# Altium schematic sheet monitoring-sources-with-mbed-hw.SchDoc
size A4; DrawnBy: Rogério J. Marcondeli / Samuel C. Z. Fraga
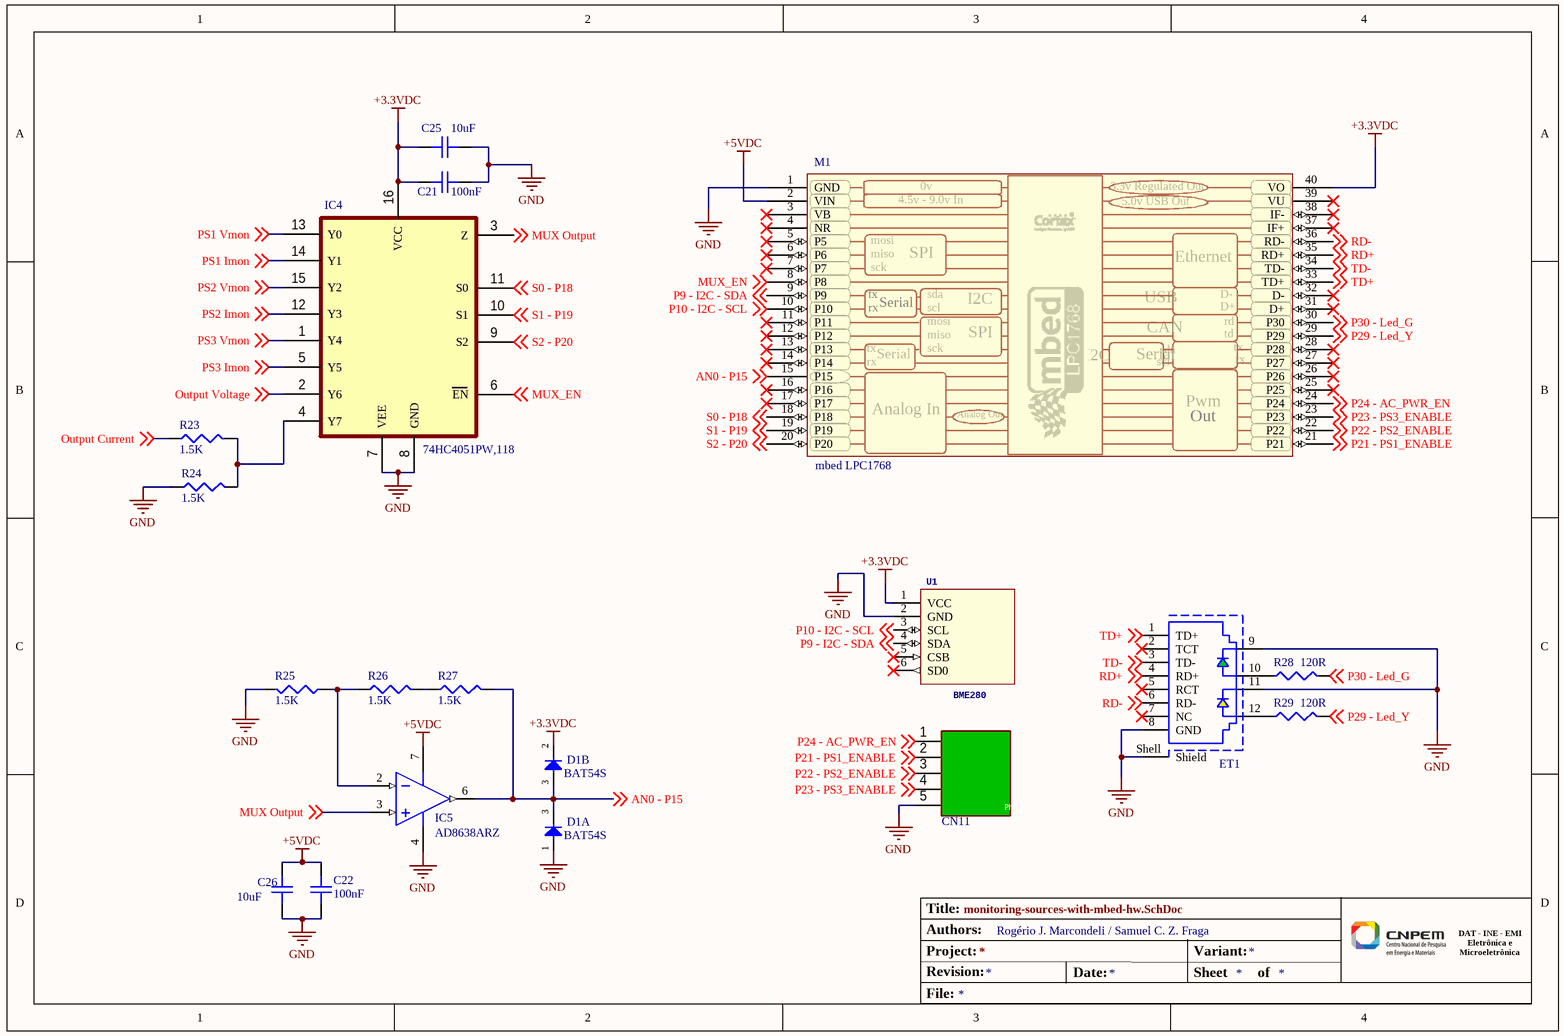
[diagram p0: monitoring-sources-with-mbed-hw.SchDoc]

## Parts
C21  100nF  [C0805]
C22  100nF  [C0805]
C25  10uF  [C0805]
C26  10uF  [C0805]
CN11  1879311  [Conector Phoenix 5 vias 1879311]  (value not drawn)
D1  BAT54S  [SOT23-3]  (parts A,B of 2)
ET1  7499010121A  [7499010121A]  (value not drawn)
IC4  8-channel analog multiplexer, TSSOP-16  [TSSOP-16]  (value not drawn)
IC5  AD8638ARZ  [SOIC-N-8]
M1  mbed LPC1768  [DIP40-LPC1768]
R23  1.5K  [R0603]
R24  1.5K  [R0603]
R25  1.5K  [R0603]
R26  1.5K  [R0603]
R27  1.5K  [R0603]
R28  120R  [R0805]
R29  120R  [R0805]
U1  BME280  [BME280]

## Nets
+3.3VDC: C21.2 C25.1 D1.2(C) IC4.16(VCC) M1.40(VO) U1.1(VCC)
+5VDC: C22.2 C26.1 IC5.7(V+) M1.2(VIN)
GND: C21.1 C22.1 C25.2 C26.2 CN11.5 D1.1(A) ET1.8(GND) ET1.9(KG) ET1.11(KY) ET1.Shell(Shield) IC4.7(VEE) IC4.8(GND) IC5.4(V-) M1.1(GND) R24.1 R25.2 U1.2(GND)
AN0 - P15: D1.3(COMAC) IC5.6(Output) M1.15(P15) R27.2 ; off-sheet AN0 - P15
MUX Output: IC4.3(Z) IC5.3(+In) ; off-sheet MUX Output
MUX_EN: IC4.6(EN) M1.8(P8) ; off-sheet MUX_EN
Output Current: R23.1 ; off-sheet Output Current
Output Voltage: IC4.2(Y6) ; off-sheet Output Voltage
P9 - I2C - SDA: M1.9(P9) U1.4(SDA) ; off-sheet P9 - I2C - SDA
P10 - I2C - SCL: M1.10(P10) U1.3(SCL) ; off-sheet P10 - I2C - SCL
P21 - PS1_ENABLE: CN11.2 M1.21(P21) ; off-sheet P21 - PS1_ENABLE
P22 - PS2_ENABLE: CN11.3 M1.22(P22) ; off-sheet P22 - PS2_ENABLE
P23 - PS3_ENABLE: CN11.4 M1.23(P23) ; off-sheet P23 - PS3_ENABLE
P24 - AC_PWR_EN: CN11.1 M1.24(P24) ; off-sheet P24 - AC_PWR_EN
P29 - Led_Y: M1.29(P29) R29.2 ; off-sheet P29 - Led_Y
P30 - Led_G: M1.30(P30) R28.2 ; off-sheet P30 - Led_G
PS1 Imon: IC4.14(Y1) ; off-sheet PS1 Imon
PS1 Vmon: IC4.13(Y0) ; off-sheet PS1 Vmon
PS2 Imon: IC4.12(Y3) ; off-sheet PS2 Imon
PS2 Vmon: IC4.15(Y2) ; off-sheet PS2 Vmon
PS3 Imon: IC4.5(Y5) ; off-sheet PS3 Imon
PS3 Vmon: IC4.1(Y4) ; off-sheet PS3 Vmon
RD+: ET1.4(RD+) M1.35(RD+) ; off-sheet RD+
RD-: ET1.6(RD-) M1.36(RD-) ; off-sheet RD-
S0 - P18: IC4.11(S0) M1.18(P18) ; off-sheet S0 - P18
S1 - P19: IC4.10(S1) M1.19(P19) ; off-sheet S1 - P19
S2 - P20: IC4.9(S2) M1.20(P20) ; off-sheet S2 - P20
TD+: ET1.1(TD+) M1.33(TD+) ; off-sheet TD+
TD-: ET1.3(TD-) M1.34(TD-) ; off-sheet TD-
NetET1_10: ET1.10(AG) R28.1
NetET1_12: ET1.12(AY) R29.1
NetIC4_4: IC4.4(Y7) R23.2 R24.2
NetIC5_2: IC5.2(-In) R25.1 R26.1
NetR26_2: R26.2 R27.1

Not connected (* = marked no-connect by the designer): ET1 2(TCT)* 5(RCT)* 7(NC)*; M1 3(VB)* 4(NR)* 5(P5)* 6(P6)* 7(P7)* 11(P11)* 12(P12)* 13(P13)* 14(P14)* 16(P16)* 17(P17)* 25(P25)* 26(P26)* 27(P27)* 28(P28)* 31(D+)* 32(D-)* 37(IF+)* 38(IF-)* 39(VU)*; U1 5(CSB)* 6(SD0)*

## Notes on the sheet
- Authors:
- Title:
- Revision:
- File:
- Project:
- Date:
- Variant:
- Sheet
- of
- DAT - INE - EMI
  Eletrônica e
  Microeletrônica
- (in symbol CONECTOR PHOENIX 5 VIAS 1879311) Phoenix Contact
- (in symbol MBED LPC1768) 0v; 3.3v Regulated Out; 4.5v - 9.0v In; 5.0v USB Out; mosi; miso; SPI; Ethernet; sck; tx; sda; Serial; I2C; USB; rx; scl; rd; CAN; td; Pwm; Analog In; Analog Out; Out

## Library data of the parts
C21 C22 = CAPACITOR 100nF/50V: Capacitor 0.1UF 50V X7R 0805; Manufacturer 1: Kyocera AVX; Manufacturer Part Number 1: 08055C104KAZ2A; Description 1: Capacitor Ceramic 0.1uF 50V X7R 10% SMD 0805 FlexiTerm 125C Paper T/R; Category 1: Ceramic Capacitors; Tolerance: 10%; Temperature Coefficient: 30ppm/°C; Dissipation Factor: 2.5%; Código LNLS: AP106675; Supplier 1: Arrow Electronics; Supplier Part Number 1: 08055C104KAZ2A; RoHS 1: Yes; Stock 1: 28000; Pricing 1: 4000=0,0262 (USD); Mount: Surface Mount,PCB; Case/Package: 0805; Number of Pins: 2; Case Code (Metric): 2012; Case Code (Imperial): 0805; Min Operating Temperature: -55°C; Max Operating Temperature: 125°C; Packaging: Tape and Reel; Capacitance: 100nF; Voltage Rating (DC): 50V; Dielectric: X7R; Package Quantity: 4000; Series: FLEXITERM®; Voltage Rating: 50V; Termination: SMD/SMT; Voltage: 50V; Features: Soft Termination; Construction: Flat; Length: 2.01mm; Width: 1.25mm; Height: 0.94mm; Depth: 1.25mm; Reach SVHC Compliant: No; Lead Free: Lead Free; RoHS Compliant: Yes; ComponentLink1URL: https://datasheet.ciiva.com/28613/630895-28613376.pdf?src-supplier=Element14; ComponentLink1Description: https://datasheet.ciiva.com/28613/630895-28613376.pdf?src-supplier=Element14; ComponentLink2URL: https://datasheet.ciiva.com/11788/0900766b80dc2409-11788550.pdf?src-supplier=Rs; ComponentLink2Description: https://datasheet.ciiva.com/11788/0900766b80dc2409-11788550.pdf?src-supplier=Rs; ComponentLink3URL: https://datasheet.ciiva.com/30514/2014094-30514066.pdf?src-supplier=Jameco; ComponentLink3Description: https://datasheet.ciiva.com/30514/2014094-30514066.pdf?src-supplier=Jameco; ComponentLink4URL: https://datasheet.ciiva.com/11499/flexiterm-11499901.pdf?src-supplier=Avnet; ComponentLink4Description: https://datasheet.ciiva.com/11499/flexiterm-11499901.pdf?src-supplier=Avnet; ComponentLink5URL: https://datasheet.ciiva.com/5417/cx7r-218113-5417323.pdf?src-supplier=Mouser; ComponentLink5Description: https://datasheet.ciiva.com/5417/cx7r-218113-5417323.pdf?src-supplier=Mouser; ComponentLink6URL: https://datasheet.ciiva.com/28613/630895-28613368.pdf?src-supplier=Element14; ComponentLink6Description: https://datasheet.ciiva.com/28613/630895-28613368.pdf?src-supplier=Element14; ComponentLink7URL: https://datasheet.ciiva.com/151/flexiterm-151512.pdf?src-supplier=Digi-Key; ComponentLink7Description: https://datasheet.ciiva.com/151/flexiterm-151512.pdf?src-supplier=Digi-Key; ComponentLink8URL: https://datasheet.ciiva.com/151/flexiterm-151513.pdf?src-supplier=Digi-Key; ComponentLink8Description: https://datasheet.ciiva.com/151/flexiterm-151513.pdf?src-supplier=Digi-Key; ComponentLink9URL: https://datasheet.ciiva.com/151/flexiterm-151514.pdf?src-supplier=Digi-Key; ComponentLink9Description: https://datasheet.ciiva.com/151/flexiterm-151514.pdf?src-supplier=Digi-Key; ComponentLink10URL: https://datasheet.ciiva.com/14602/70001075-14602617.pdf?src-supplier=Allied+Electronics; ComponentLink10Description: https://datasheet.ciiva.com/14602/70001075-14602617.pdf?src-supplier=Allied+Electronics; ComponentLink11URL: https://datasheet.ciiva.com/16427/cx7r-16427406.pdf?src-supplier=Future+Electronics; ComponentLink11Description: https://datasheet.ciiva.com/16427/cx7r-16427406.pdf?src-supplier=Future+Electronics
C25 C26 = CAPACITOR 10uF/35V: Capacitor 10UF 35V X5R 0805; Manufacturer: TDK; Manufacturer Part Number: C2012X5R1V106K085AC; Dielectric Material: Ceramic; Tolerance: 10%; Código LNLS: AP105062; Supplier 1: Digi-Key; Stock 1: 56135; Pricing 1: 1=0.73, 10=0.519, 100=0.3416, 500=0.253, 1000=0.2151 (USD); Case/Package: 0805; Weight: 0.000194oz; Case Code (Metric): 2012; Case Code (Imperial): 0805; Min Operating Temperature: -55°C; Max Operating Temperature: 85°C; Package Quantity: 1; Packaging: Tape and Reel; Capacitance: 10uF; Voltage Rating: 35V; Dielectric: X5R; Termination: SMD/SMT; Voltage Rating (DC): 35V; Length: 0.079inch; Height: 0.85mm; Width: 0.049inch; Thickness: 0.039inch; REACH SVHC: No SVHC; Lead Free: Lead Free; ComponentLink1URL: https://datasheet.ciiva.com/14894/tdkmlcccaprange-14894527.pdf; ComponentLink1Description: https://datasheet.ciiva.com/14894/tdkmlcccaprange-14894527.pdf; Supplier Part Number 1: 445-14417-1-ND
CN11 = CONECTOR PHOENIX 5 VIAS 1879311: Código LNLS: AP102667; ComponentLink1Description: https://www.onlinecomponents.com/en/datasheet/emcv155gf381-48817554/; ComponentLink1URL: https://www.onlinecomponents.com/en/datasheet/emcv155gf381-48817554/
D1 = Diodo BAT54S: 200mA Schottky Diode, 30 VRRM, Cascade Configutation, SMD SOT-23; Manufacturer 1: ON Semiconductor / Fairchild; Manufacturer Part Number 1: BAV99WT1G; Description 1: Diode Ultra Fast Recovery Rectifier 70V 0.2A 3-Pin SOT-323 T/R; Category 1: Rectifier Diodes; Max Surge Current: 2A; Recovery Time: 6ns; Power Dissipation: 300mW; Max Reverse Current: 2.5uA; Forward Voltage: 1.25V; Max Repetitive Reverse Voltage (Vrrm): 70V; Average Rectified Current: 215mA; Max Reverse Voltage (DC): 100V; Max Reverse Leakage Current: 2.4uA; Código LNLS: MT103197; Author: CERN DEM JLC; Supplier 1: Mouser; Supplier Part Number 1: 863-BAV99WT1G; RoHS 1: Yes; Stock 1: 247099; Pricing 1: 1=0,16, 10=0,115, 50=0,115, 100=0,049, 1000=0,034, 10000=0,022 (USD); Mount: Surface Mount; Case/Package: SOT-323; Number of Pins: 3; Contact Plating: Tin,Matte; Weight: 0.03g; Min Operating Temperature: -65°C; Max Operating Temperature: 150°C; Packaging: Tape and Reel; Package Quantity: 1; Reverse Recovery Time: 6ns; Forward Current: 200mA; Reverse Voltage: 70V; Series: -; Peak Non-Repetitive Surge Current: 2A; Max Forward Surge Current (Ifsm): 2A; Termination: SMD/SMT; Reverse Recovery Time-Max: 6ns; Length: 2.1mm; Width: 1.24mm; Height: 0.85mm; Radiation Hardening: No; RoHS Compliant: Yes; Reach SVHC Compliant: No; Lead Free: Lead Free; ComponentLink1URL: https://datasheet.ciiva.com/5794/bav99wt1-d-5794016.pdf?src-supplier=Farnell; ComponentLink1Description: https://datasheet.ciiva.com/5794/bav99wt1-d-5794016.pdf?src-supplier=Farnell; ComponentLink2URL: https://datasheet.ciiva.com/905/bav99wt1-d-905792.pdf?src-supplier=Digi-Key; ComponentLink2Description: https://datasheet.ciiva.com/905/bav99wt1-d-905792.pdf?src-supplier=Digi-Key; ComponentLink3URL: https://datasheet.ciiva.com/4452/bav99wt1g-105474-4452790.pdf?src-supplier=Mouser; ComponentLink3Description: https://datasheet.ciiva.com/4452/bav99wt1g-105474-4452790.pdf?src-supplier=Mouser; ComponentLink4URL: https://datasheet.ciiva.com/8303/bav99wt1g-8303685.pdf?src-supplier=Avnet; ComponentLink4Description: https://datasheet.ciiva.com/8303/bav99wt1g-8303685.pdf?src-supplier=Avnet; ComponentLink5URL: https://datasheet.ciiva.com/16742/bav99wt1g-16742585.pdf?src-supplier=Future+Electronics; ComponentLink5Description: https://datasheet.ciiva.com/16742/bav99wt1g-16742585.pdf?src-supplier=Future+Electronics; ComponentLink6URL: https://datasheet.ciiva.com/46428/1863368-46428599.pdf?src-supplier=Element14; ComponentLink6Description: https://datasheet.ciiva.com/46428/1863368-46428599.pdf?src-supplier=Element14; ComponentLink7URL: https://datasheet.ciiva.com/905/bav99wt1-d-905793.pdf?src-supplier=Digi-Key; ComponentLink7Description: https://datasheet.ciiva.com/905/bav99wt1-d-905793.pdf?src-supplier=Digi-Key; ComponentLink8URL: https://datasheet.ciiva.com/905/bav99wt1-d-905794.pdf?src-supplier=Digi-Key; ComponentLink8Description: https://datasheet.ciiva.com/905/bav99wt1-d-905794.pdf?src-supplier=Digi-Key; ComponentLink9URL: https://datasheet.ciiva.com/906/bav99wt1g-906843.pdf?src-supplier=Digi-Key; ComponentLink9Description: https://datasheet.ciiva.com/906/bav99wt1g-906843.pdf?src-supplier=Digi-Key; ComponentLink10URL: https://datasheet.ciiva.com/1180/bav99wt1-d-1180786.pdf?src-supplier=Element14; ComponentLink10Description: https://datasheet.ciiva.com/1180/bav99wt1-d-1180786.pdf?src-supplier=Element14
ET1 = 7499010121A: WE-RJ45 LAN Transformer, THT, 1 Port, 10/100 Base-T, Tab Up; Manufacturer 1: Wurth Electronics; Description 1: Telecom and Datacom Connector, 8 Contact(s), Right Angle, Solder Terminal; Category 1: Modular / Ethernet Connectors; Gender: Female; Shielding: Shielded; Connector Type: RJ45,Socket; Number of Ports: 1; Number of Positions: 8; Number of Cores per Jack: 4; Pitch: 2.54mm; Código LNLS: AP105640; Supplier 1: Mouser; Supplier Part Number 1: 710-7499010121A; Manufacturer Part Number 1: 7499010121A; RoHS 1: Yes; Stock 1: 3025; Pricing 1: 1=6,71, 10=6,52, 50=6,2, 100=5,89, 1000=5,26, 10000=5,26 (USD); Mount: Through Hole,PCB; Case/Package: Metal; Contact Plating: Gold; Color: Green,Yellow,Silver; Contact Material: Ferrite,Tin,Gold; Housing Material: Thermoplastic; Min Operating Temperature: 0°C; Max Operating Temperature: 70°C; Packaging: Rail/Tube; Termination: Through Hole; Series: WE-RJ45 LAN; Number of Rows: 1; Direction: Up; Number of Contacts: 8; Number of Ways: 8; Length: 13.5mm; Width: 16.2mm; Depth: 25.3mm; Reach SVHC Compliant: No; Lead Free: Lead Free; RoHS Compliant: Yes; Flammability Rating: UL94 V-0; ComponentLink1URL: https://datasheet.ciiva.com/11726/0900766b80f8867f-11726148.pdf?src-supplier=Rs; ComponentLink1Description: https://datasheet.ciiva.com/11726/0900766b80f8867f-11726148.pdf?src-supplier=Rs; ComponentLink2URL: https://datasheet.ciiva.com/24091/7499010121a-254210-24091293.pdf?src-supplier=Mouser; ComponentLink2Description: https://datasheet.ciiva.com/24091/7499010121a-254210-24091293.pdf?src-supplier=Mouser; ComponentLink3URL: https://datasheet.ciiva.com/1108/1736687-1108264.pdf?src-supplier=Element14; ComponentLink3Description: https://datasheet.ciiva.com/1108/1736687-1108264.pdf?src-supplier=Element14; ComponentLink4URL: https://datasheet.ciiva.com/6913/7499010121-6913964.pdf?src-supplier=Newark; ComponentLink4Description: https://datasheet.ciiva.com/6913/7499010121-6913964.pdf?src-supplier=Newark; ComponentLink5URL: https://datasheet.ciiva.com/6932/7499010121-6932396.pdf?src-supplier=Digi-Key; ComponentLink5Description: https://datasheet.ciiva.com/6932/7499010121-6932396.pdf?src-supplier=Digi-Key; ComponentLink6URL: https://datasheet.ciiva.com/16406/7499010121a-16406843.pdf?src-supplier=Future+Electronics; ComponentLink6Description: https://datasheet.ciiva.com/16406/7499010121a-16406843.pdf?src-supplier=Future+Electronics; ComponentLink7URL: https://datasheet.ciiva.com/48689/001088877-da-01-en-integrated-rj45-we-rj45lan-7499010121a-48689514.pdf?src-supplier=Conrad; ComponentLink7Description: https://datasheet.ciiva.com/48689/001088877-da-01-en-integrated-rj45-we-rj45lan-7499010121a-48689514.pdf?src-supplier=Conrad
IC4 = 74HC4051PW,118: Manufacturer 1: Nexperia; Description 1: 74HC Series 10 V 8-Channel Analog Multiplexer/Demultiplexer - TSSOP-16; Category 1: Decoders and Multiplexers; Código LNLS: AP103267; Supplier 1: Mouser; Supplier Part Number 1: 771-74HC4051PW-T; Manufacturer Part Number 1: 74HC4051PW,118; RoHS 1: Yes; Stock 1: 33728; Pricing 1: 1=0,44, 10=0,356, 50=0,356, 100=0,264, 500=0,22, 1000=0,17, 2500=0,138, 10000=0,126, 25000=0,122, 50000=0,121 (USD); RoHS Compliant: Yes; ComponentLink1URL: https://assets.nexperia.com/documents/data-sheet/74HC_HCT4051.pdf?src-supplier=Digi-Key; ComponentLink1Description: https://assets.nexperia.com/documents/data-sheet/74HC_HCT4051.pdf?src-supplier=Digi-Key; ComponentLink2URL: https://datasheet.octopart.com/74HC4051PW%2C118-Nexperia-datasheet-12517090.pdf?src-supplier=Newark; ComponentLink2Description: https://datasheet.octopart.com/74HC4051PW%2C118-Nexperia-datasheet-12517090.pdf?src-supplier=Newark; ComponentLink3URL: https://datasheet.octopart.com/74HC4051PW%2C118-Nexperia-datasheet-62118378.pdf?src-supplier=Future+Electronics; ComponentLink3Description: https://datasheet.octopart.com/74HC4051PW%2C118-Nexperia-datasheet-62118378.pdf?src-supplier=Future+Electronics
IC5 = AD8638ARZ: Precision Amplifiers 16V Auto-Zero CMOS Amplifier; Manufacturer 1: Analog Devices; Description 1: Auto-Zero Amplifier 1 Circuit Rail-to-Rail 8-SOIC; Category 1: Amplifiers - Op Amps, Buffer, Instrumentation; Unity Gain Bandwidth Product: 1.35MHz; Common Mode Rejection Ratio: 127dB; Min Supply Voltage: 5V; Voltage Gain: 136dB; Min Dual Supply Voltage: 2.5V; Max Dual Supply Voltage: 8V; Slew Rate: 2V/µs; Number of Channels: 1; Input Bias Current: 1pA; Input Offset Voltage (Vos): 9uV; Input Voltage Noise Density: 60nV/sqrt Hz; Power Supply Rejection Ratio (PSRR): 143dB; Gain Bandwidth Product: 1.5MHz; Operating Supply Current: 1.5mA; Output Current per Channel: 37mA; Operating Supply Voltage: 15V; Código LNLS: MC132509; Supplier 1: Mouser; Supplier Part Number 1: 584-AD8638ARZ; Manufacturer Part Number 1: AD8638ARZ; RoHS 1: Yes; Stock 1: 4968; Pricing 1: 1=3,67, 10=3,12, 50=3,12, 100=2,76, 1000=2,35, 10000=1,88 (USD); Case/Package: R; Number of Pins: 8; Contact Plating: Tin,Matte; Min Operating Temperature: -40°C; Max Operating Temperature: 125°C; Max Supply Voltage: 16V; Packaging: Rail/Tube; Package Quantity: 98; Number of Circuits: 1; Number of Elements: 1; Number of Amplifiers: 1; Quiescent Current: 1.5mA; Series: -; Bandwidth: 1.5MHz; Dual Supply Voltage: 5V; Length: 5mm; Width: 4mm; Height: 1.5mm; Radiation Hardening: No; Lead Free: Contains Lead; RoHS Compliant: Yes; Reach SVHC Compliant: No; ComponentLink1URL: https://datasheet.ciiva.com/1135/679724-1135905.pdf?src-supplier=Element14; ComponentLink1Description: https://datasheet.ciiva.com/1135/679724-1135905.pdf?src-supplier=Element14; ComponentLink2URL: https://datasheet.ciiva.com/2973/ad8638-8639-2973113.pdf?src-supplier=Avnet; ComponentLink2Description: https://datasheet.ciiva.com/2973/ad8638-8639-2973113.pdf?src-supplier=Avnet; ComponentLink3URL: https://datasheet.ciiva.com/1794/ad8638-8639-1794397.pdf?src-supplier=Digi-Key; ComponentLink3Description: https://datasheet.ciiva.com/1794/ad8638-8639-1794397.pdf?src-supplier=Digi-Key; ComponentLink4URL: https://datasheet.ciiva.com/48705/001249426-da-01-en-ic-opamp-chopper-r-ad8638arz-soic-8-adi-48705866.pdf?src-supplier=Conrad; ComponentLink4Description: https://datasheet.ciiva.com/48705/001249426-da-01-en-ic-opamp-chopper-r-ad8638arz-soic-8-adi-48705866.pdf?src-supplier=Conrad
M1 = MBED LPC1768: Mbed LPC 1768
R23-R27 = RESISTOR 1.5K: Resistor SMD 1.5K OHM 0.1% 1/10W 0603; Manufacturer 1: Panasonic; Manufacturer Part Number 1: ERA-3AEB152V; Description 1: Res Thin Film 0603 1.5K Ohm 0.1% 0.1W ±25ppm/°C Molded SMD Punched Carrier T/R; Category 1: Chip SMD Resistors; Resistance: 1.5kR; Temperature Coefficient: 25ppm/°C; Power Rating: 100mW; Voltage Rating: 75V; Código LNLS: MT103626; Supplier 1: Mouser; Supplier Part Number 1: 667-ERA-3AEB152V; RoHS 1: Yes; Stock 1: 5568; Pricing 1: 1=0,34, 10=0,23, 50=0,23, 100=0,094, 1000=0,05, 10000=0,036 (USD); Mount: Surface Mount; Case/Package: 0603; Number of Pins: 2; Contact Plating: Tin; Case Code (Metric): 1608; Case Code (Imperial): 0603; Size Code: 0603; Min Operating Temperature: -55°C; Max Operating Temperature: 155°C; Tolerance: 0.1%; Resistor Type: Thin Film; Packaging: Tape and Reel; Package Quantity: 1; Number of Terminations: 2; Termination: SMD/SMT; Max Power Dissipation: 100mW; Voltage Rating (DC): 75V; Features: Automotive AEC-Q200; Series: ERA-3A; Resistance Tolerance: 0.1%; Technology: METAL FILM; Length: 1.6mm; Width: 0.8mm; Height: 0.45mm; Depth: 0.8mm; Ratings: AEC-Q200; Radiation Hardening: No; Reach SVHC Compliant: No; Lead Free: Lead Free; RoHS Compliant: Yes; ComponentLink1URL: https://datasheet.ciiva.com/11811/0900766b80beefcc-11811712.pdf?src-supplier=Rs; ComponentLink1Description: https://datasheet.ciiva.com/11811/0900766b80beefcc-11811712.pdf?src-supplier=Rs; ComponentLink2URL: https://datasheet.ciiva.com/29183/450830-da-01-en-widerstand-0603-era-29183764.pdf?src-supplier=Conrad; ComponentLink2Description: https://datasheet.ciiva.com/29183/450830-da-01-en-widerstand-0603-era-29183764.pdf?src-supplier=Conrad; ComponentLink3URL: https://datasheet.ciiva.com/9117/aoa0000ce26-9117365.pdf?src-supplier=Avnet; ComponentLink3Description: https://datasheet.ciiva.com/9117/aoa0000ce26-9117365.pdf?src-supplier=Avnet; ComponentLink4URL: https://datasheet.ciiva.com/5734/485442-5734538.pdf?src-supplier=Farnell; ComponentLink4Description: https://datasheet.ciiva.com/5734/485442-5734538.pdf?src-supplier=Farnell; ComponentLink5URL: https://datasheet.ciiva.com/5734/485442-5734539.pdf?src-supplier=Farnell; ComponentLink5Description: https://datasheet.ciiva.com/5734/485442-5734539.pdf?src-supplier=Farnell; ComponentLink6URL: https://datasheet.ciiva.com/46422/485442-46422565.pdf?src-supplier=Element14; ComponentLink6Description: https://datasheet.ciiva.com/46422/485442-46422565.pdf?src-supplier=Element14; ComponentLink7URL: https://datasheet.ciiva.com/16760/70068849-16760629.pdf?src-supplier=Allied+Electronics; ComponentLink7Description: https://datasheet.ciiva.com/16760/70068849-16760629.pdf?src-supplier=Allied+Electronics; ComponentLink8URL: https://datasheet.ciiva.com/7830/485442-7830591.pdf?src-supplier=Element14; ComponentLink8Description: https://datasheet.ciiva.com/7830/485442-7830591.pdf?src-supplier=Element14; ComponentLink9URL: https://datasheet.ciiva.com/28513/485442-28513834.pdf?src-supplier=Element14; ComponentLink9Description: https://datasheet.ciiva.com/28513/485442-28513834.pdf?src-supplier=Element14; ComponentLink10URL: https://datasheet.ciiva.com/30146/54aoa0000ce26-30146117.pdf?src-supplier=Onlinecomponents.com; ComponentLink10Description: https://datasheet.ciiva.com/30146/54aoa0000ce26-30146117.pdf?src-supplier=Onlinecomponents.com; ComponentLink11URL: https://datasheet.ciiva.com/48530/era-eng-tds-48530507.pdf?src-supplier=Distrelec; ComponentLink11Description: https://datasheet.ciiva.com/48530/era-eng-tds-48530507.pdf?src-supplier=Distrelec
R28 R29 = RESISTOR 120R: Resistor SMD 120R OHM 1% 1/8W 0805; Manufacturer 1: Panasonic; Manufacturer Part Number 1: ERJ-6ENF1200V; Description 1: SMD Chip Resistor, 120 Ohm, ± 1%, 125 mW, 0805 [2012 Metric], Thick Film, Precision; Category 1: Chip SMD Resistors; Temperature Coefficient: 100ppm/°C; Power Rating: 125mW; Voltage Rating: 150V; Código LNLS: MT100270; Supplier 1: Mouser; Supplier Part Number 1: 667-ERJ-6ENF1200V; RoHS 1: Yes; Stock 1: 119970; Pricing 1: 1=0,1, 10=0,043, 50=0,043, 100=0,019, 1000=0,014, 10000=0,009 (USD); Mount: Surface Mount; Case/Package: 0805; Number of Pins: 2; Contact Plating: Tin; Case Code (Imperial): 0805; Case Code (Metric): 2012; Min Operating Temperature: -55°C; Max Operating Temperature: 155°C; Resistance: 120R; Tolerance: 1%; Resistor Type: Thick Film; Packaging: Tape and Reel; Package Quantity: 1; Termination: SMD/SMT; Number of Terminations: 2; Max Power Dissipation: 125mW; Features: Automotive AEC-Q200; Series: ERJ; Resistance Tolerance: 1%; Construction: Rectangular; Technology: THICK FILM; Voltage Rating (DC): 150V; Length: 2mm; Width: 1.2mm; Height: 0.6mm; Depth: 1.25mm; Radiation Hardening: No; Reach SVHC Compliant: No; Military Standard: Not; RoHS Compliant: Yes; ComponentLink1URL: https://datasheet.ciiva.com/11821/0900766b80f80784-11821533.pdf?src-supplier=Rs; ComponentLink1Description: https://datasheet.ciiva.com/11821/0900766b80f80784-11821533.pdf?src-supplier=Rs; ComponentLink2URL: https://datasheet.ciiva.com/6082/426256-6082139.pdf?src-supplier=Farnell; ComponentLink2Description: https://datasheet.ciiva.com/6082/426256-6082139.pdf?src-supplier=Farnell; ComponentLink3URL: https://datasheet.ciiva.com/7886/426256-7886749.pdf?src-supplier=Element14; ComponentLink3Description: https://datasheet.ciiva.com/7886/426256-7886749.pdf?src-supplier=Element14; ComponentLink4URL: https://datasheet.ciiva.com/46373/1678782-46373272.pdf?src-supplier=Element14; ComponentLink4Description: https://datasheet.ciiva.com/46373/1678782-46373272.pdf?src-supplier=Element14; ComponentLink5URL: https://datasheet.ciiva.com/22687/1678782-22687419.pdf?src-supplier=Element14; ComponentLink5Description: https://datasheet.ciiva.com/22687/1678782-22687419.pdf?src-supplier=Element14; ComponentLink6URL: https://datasheet.ciiva.com/16782/70260748-16782215.pdf?src-supplier=Allied+Electronics; ComponentLink6Description: https://datasheet.ciiva.com/16782/70260748-16782215.pdf?src-supplier=Allied+Electronics; ComponentLink7URL: https://datasheet.ciiva.com/16765/70260748-16765246.pdf?src-supplier=Allied+Electronics; ComponentLink7Description: https://datasheet.ciiva.com/16765/70260748-16765246.pdf?src-supplier=Allied+Electronics; ComponentLink8URL: https://datasheet.ciiva.com/9117/aoa0000ce2-9117405.pdf?src-supplier=Avnet; ComponentLink8Description: https://datasheet.ciiva.com/9117/aoa0000ce2-9117405.pdf?src-supplier=Avnet; ComponentLink9URL: https://datasheet.ciiva.com/15158/getdatasheetpartid-248620-15158999.pdf?src-supplier=Verical; ComponentLink9Description: https://datasheet.ciiva.com/15158/getdatasheetpartid-248620-15158999.pdf?src-supplier=Verical; ComponentLink10URL: https://datasheet.ciiva.com/22673/1678782-22673701.pdf?src-supplier=Element14; ComponentLink10Description: https://datasheet.ciiva.com/22673/1678782-22673701.pdf?src-supplier=Element14; ComponentLink11URL: https://datasheet.ciiva.com/46373/1678782-46373273.pdf?src-supplier=Element14; ComponentLink11Description: https://datasheet.ciiva.com/46373/1678782-46373273.pdf?src-supplier=Element14; ComponentLink12URL: https://datasheet.ciiva.com/24069/aoa0000ce2-24069192.pdf?src-supplier=Mouser; ComponentLink12Description: https://datasheet.ciiva.com/24069/aoa0000ce2-24069192.pdf?src-supplier=Mouser